# Altium schematic sheet P4_DSPBypass.SchDoc
size 203 x 127 mm
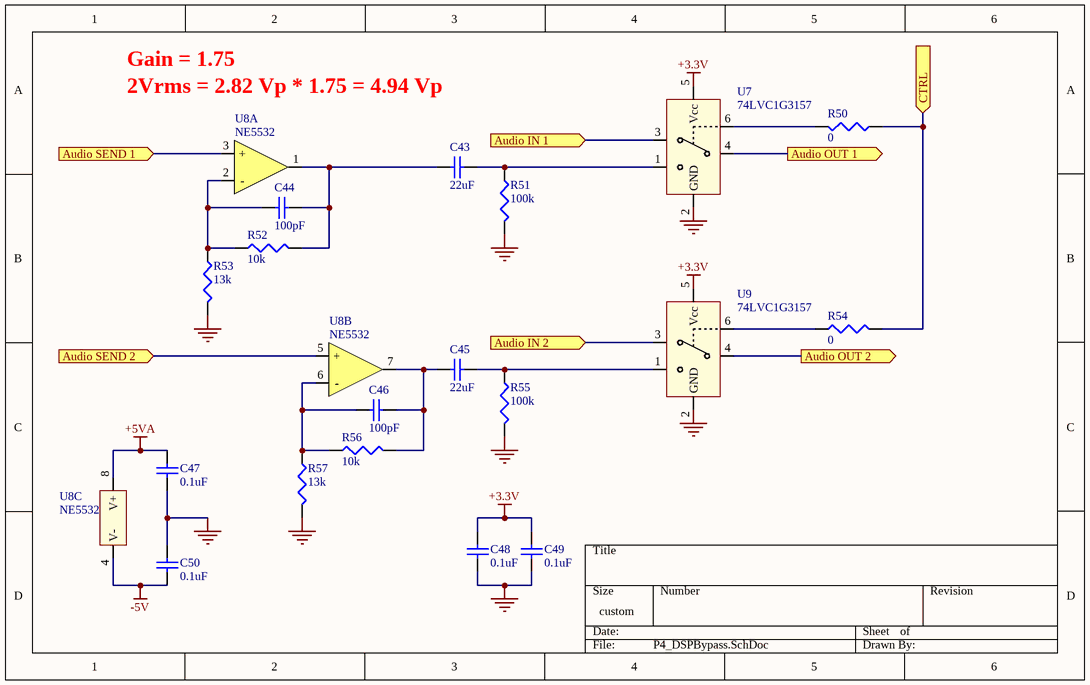
[diagram p0: P4_DSPBypass.SchDoc]

## Parts
C43  22uF  [CAP 0603 (1608 metric)]
C44  100pF  [CAP 0603 (1608 metric)]
C45  22uF  [CAP 0603 (1608 metric)]
C46  100pF  [CAP 0603 (1608 metric)]
C47  0.1uF  [CAP 0603 (1608 metric)]
C48  0.1uF  [CAP 0603 (1608 metric)]
C49  0.1uF  [CAP 0603 (1608 metric)]
C50  0.1uF  [CAP 0603 (1608 metric)]
R50  0  [RES 0603 (1608 metric)]
R51  100k  [RES 0603 (1608 metric)]
R52  10k  [RES 0603 (1608 metric)]
R53  13k  [RES 0603 (1608 metric)]
R54  0  [RES 0603 (1608 metric)]
R55  100k  [RES 0603 (1608 metric)]
R56  10k  [RES 0603 (1608 metric)]
R57  13k  [RES 0603 (1608 metric)]
U7  74LVC1G3157
U8  NE5532  (parts A,B,C of 3)
U9  74LVC1G3157

## Ports
Audio IN 1 (in), Audio IN 2 (in), Audio OUT 1 (out), Audio OUT 2 (out), Audio SEND 1 (in), Audio SEND 2 (in), CTRL (in)

## Nets
+3.3V: C48.1 C49.1 U7.5(Vcc) U9.5(Vcc)
+5VA: C47.1 U8.8(V+)
-5V: C50.2 U8.4(V-)
GND: C47.2 C48.2 C49.2 C50.1 R51.2 R53.2 R55.2 R57.2 U7.2(GND) U9.2(GND)
Audio IN 1: U7.3(B1) ; port Audio IN 1
Audio IN 2: U9.3(B1) ; port Audio IN 2
Audio OUT 1: U7.4(A) ; port Audio OUT 1
Audio OUT 2: U9.4(A) ; port Audio OUT 2
Audio SEND 1: U8.3(+) ; port Audio SEND 1
Audio SEND 2: U8.5(+) ; port Audio SEND 2
CTRL: R50.1 R54.2 ; port CTRL
NetC43_1: C43.1 R51.1 U7.1(B2)
NetC43_2: C43.2 C44.2 R52.2 U8.1(OUT)
NetC44_1: C44.1 R52.1 R53.1 U8.2(-)
NetC45_1: C45.1 R55.1 U9.1(B2)
NetC45_2: C45.2 C46.2 R56.2 U8.7(OUT)
NetC46_1: C46.1 R56.1 R57.1 U8.6(-)
NetR50_2: R50.2 U7.6(S)
NetR54_1: R54.1 U9.6(S)

## Notes on the sheet
- Gain = 1.75
- 2Vrms = 2.82 Vp * 1.75 = 4.94 Vp

## Library data of the parts
C43-C50 = Cap Semi: Capacitor (Semiconductor SIM Model)
  C43 C45: Value: 22uF
  C44 C46: Value: 100pF
  C47-C50: Value: 0.1uF
R50-R57 = Res3: Resistor
  R50 R54: Value: 0
  R51 R55: Value: 100k
  R52 R56: Value: 10k
  R53 R57: Value: 13k
U7 U9 = 74LVC1G3157: Single 2:1 Multiplexer
U8 = NE5532: Dual Audio OpAmp